# Altium schematic sheet GNSS.SchDoc (part 2 of 3)
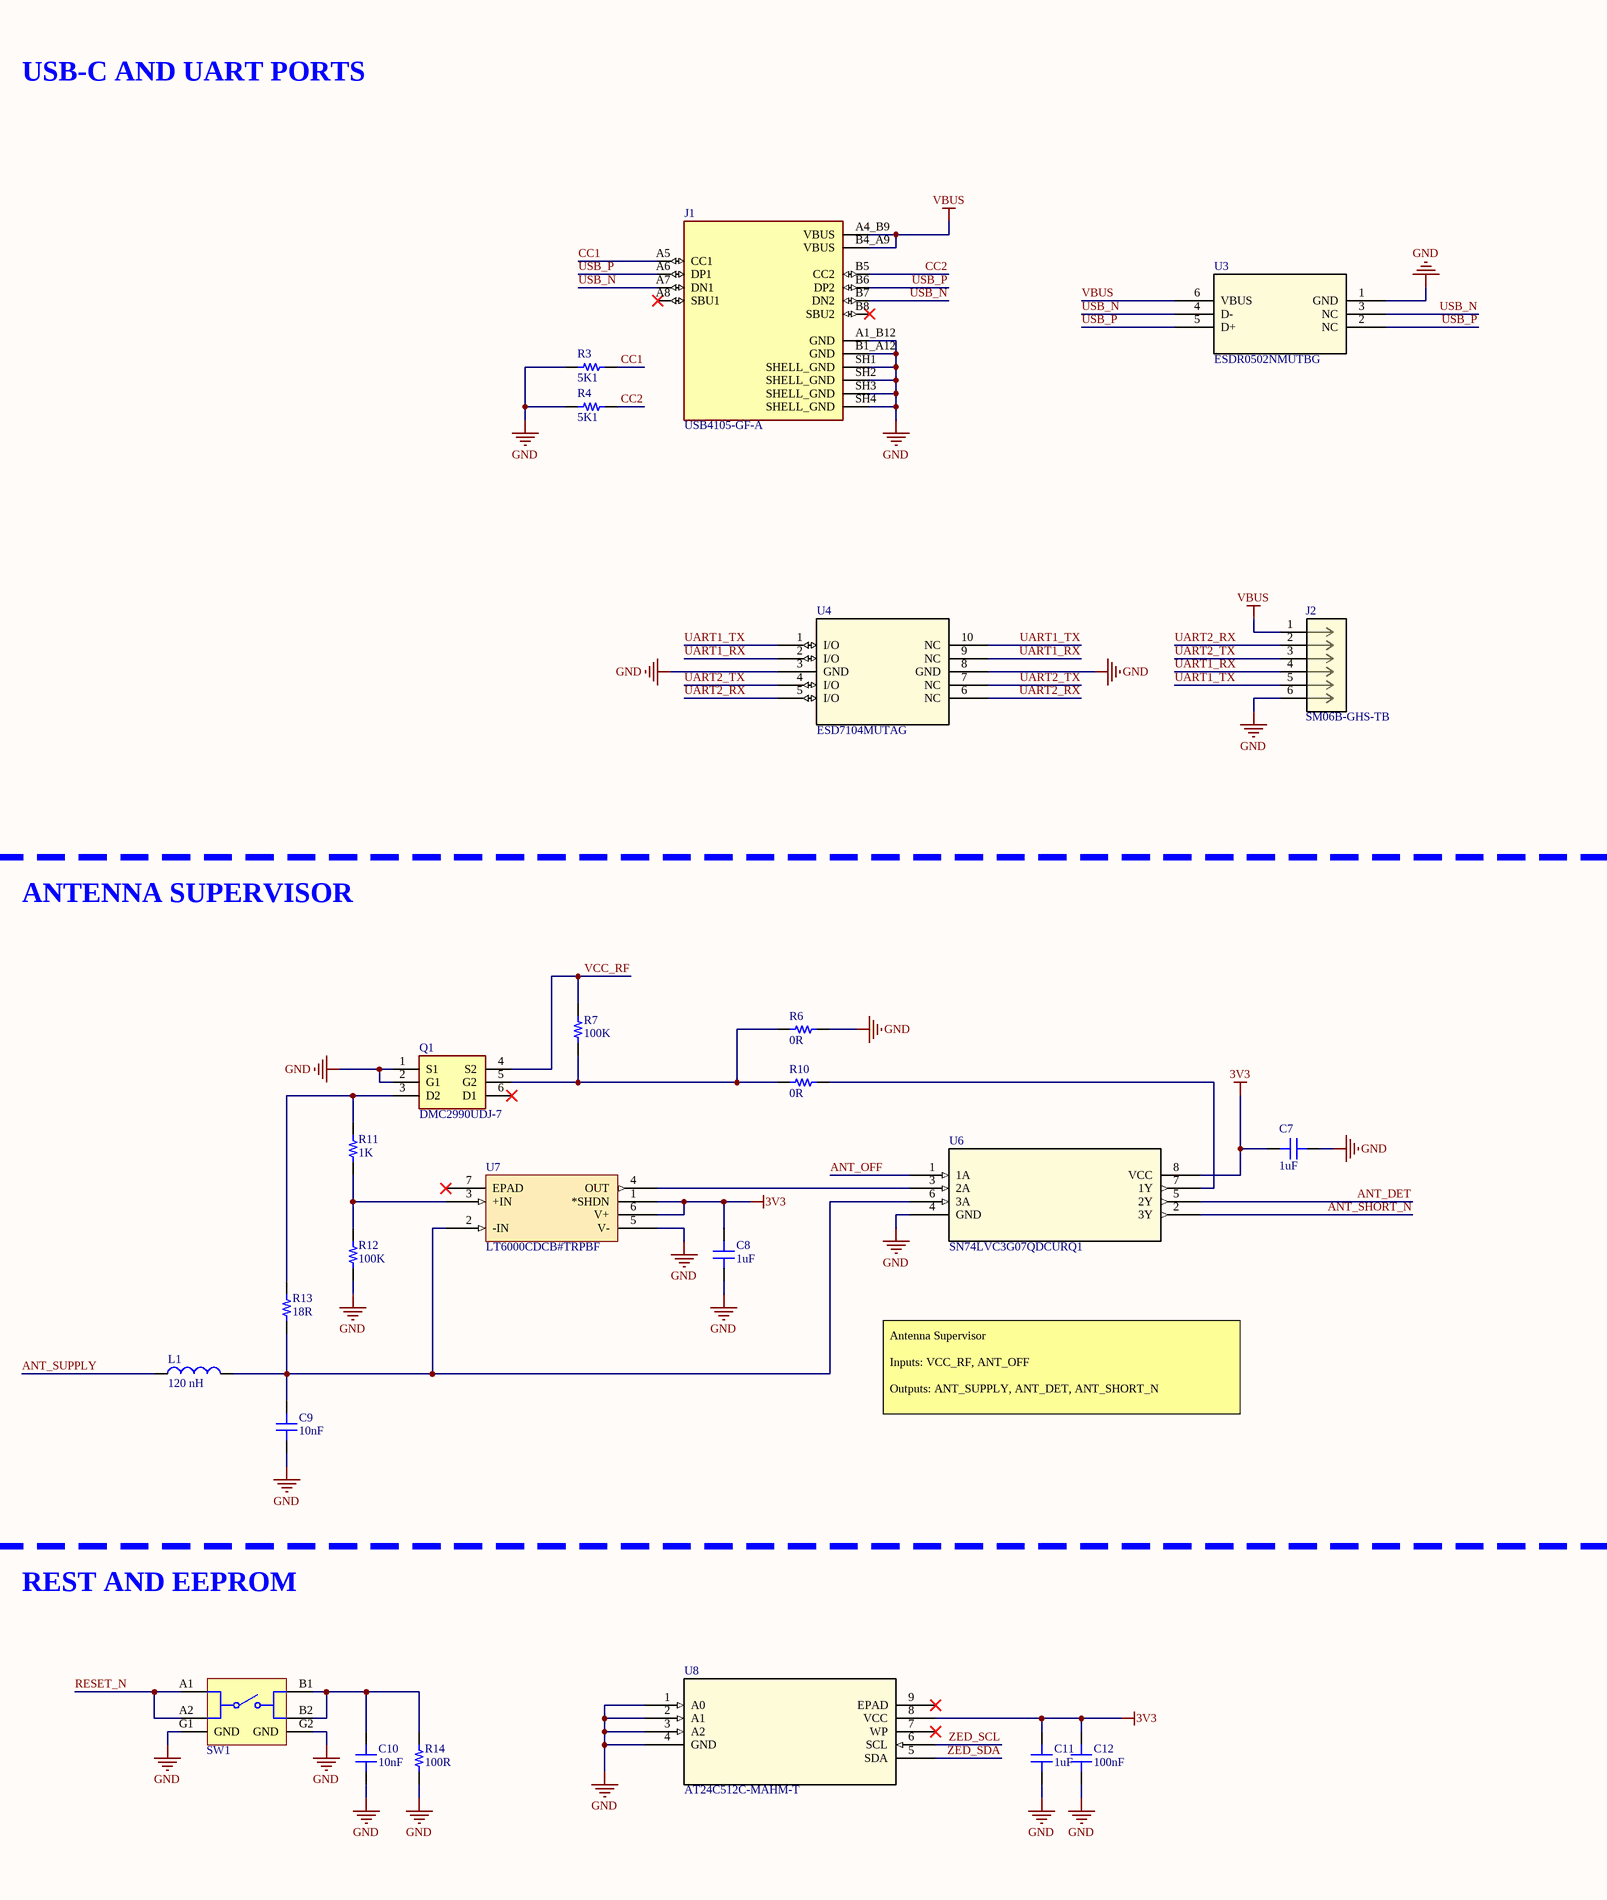
[diagram p2: GNSS.SchDoc, right]
## Library data of the parts
BT1 = MS621FE-FL11E: Coin, 6.8mm 3 V Lithium Battery Rechargeable (Secondary) 5.5mAh; MF: Seiko Instruments; Value: *; Purchase-URL: https://pricing.snapeda.com/search/part/MS621FE-FL11E/?ref=eda; Package: QFP-128 Seiko; Availability: In Stock; Check_prices: https://www.snapeda.com/parts/MS621FE-FL11E/Seiko+Instruments/view-part/?ref=eda; Price: None; SnapEDA_Link: https://www.snapeda.com/parts/MS621FE-FL11E/Seiko+Instruments/view-part/?ref=snap; MPN: MS621FE-FL11E
C1 C2 = GRM155R61A106ME11D: Ceramic Capacitor, Ceramic, 10V, 20% +Tol, 20% -Tol, X5R, 15% TC, 10uF, Surface Mount, 0402; Manufacturer: Murata; Manufacturer Lifecycle Status: IN PRODUCTION; Value: 10µF; Supplier: DigiKey; Supplier Part Number: 490-GRM155R61A106ME11DCT-ND; MPN: GRM155R61A106ME11D; RoHS: Compliant; Category: Ceramic Capacitors; Stock: 1548065; Pricing: 1=0.08, 10=0.014 (USD); Case/Package: 0402; Dielectric: X5R; Dielectric Material: Ceramic; Height: 500µm; Length: 1mm; Lifecycle Status: Production; Material: Ceramic; Max Operating Temperature: 85°C; Min Operating Temperature: -55°C; Mounting Technology: Surface Mount; Number of Terminals: 2; REACH SVHC: Yes; Thickness: 500µm; Tolerance: 20%; Voltage Rating: 10V; Voltage Rating (DC): 10V; Width: 500µm; ComponentLink1URL: https://datasheet.octopart.com:443/GRM155R61A106ME11D-Murata-datasheet-155239053.pdf?src-supplier=Newark; ComponentLink1Description: https://datasheet.octopart.com:443/GRM155R61A106ME11D-Murata-datasheet-155239053.pdf?src-supplier=Newark; ComponentLink2URL: https://datasheet.octopart.com:443/GRM155R61A106ME11D-Murata-datasheet-178522865.pdf?src-supplier=Arrow.cn; ComponentLink2Description: https://datasheet.octopart.com:443/GRM155R61A106ME11D-Murata-datasheet-178522865.pdf?src-supplier=Arrow.cn; ComponentLink3URL: https://datasheet.octopart.com:443/GRM155R61A106ME11D-Murata-datasheet-165579666.pdf?src-supplier=TME; ComponentLink3Description: https://datasheet.octopart.com:443/GRM155R61A106ME11D-Murata-datasheet-165579666.pdf?src-supplier=TME; ComponentLink4URL: https://datasheet.octopart.com:443/GRM155R61A106ME11D-Murata-datasheet-141266224.pdf?src-supplier=Ciiva; ComponentLink4Description: https://datasheet.octopart.com:443/GRM155R61A106ME11D-Murata-datasheet-141266224.pdf?src-supplier=Ciiva; ComponentLink5URL: https://datasheet.octopart.com:443/GRM155R61A106ME11D-Murata-datasheet-140689744.pdf?src-supplier=Ciiva; ComponentLink5Description: https://datasheet.octopart.com:443/GRM155R61A106ME11D-Murata-datasheet-140689744.pdf?src-supplier=Ciiva; ComponentLink6URL: https://datasheet.octopart.com:443/GRM155R61A106ME11D-Murata-datasheet-138740692.pdf?src-supplier=Ciiva; ComponentLink6Description: https://datasheet.octopart.com:443/GRM155R61A106ME11D-Murata-datasheet-138740692.pdf?src-supplier=Ciiva; ComponentLink7URL: https://datasheet.octopart.com/GRM155R61A106ME11D-Murata-datasheet-12515295.pdf; ComponentLink7Description: https://datasheet.octopart.com/GRM155R61A106ME11D-Murata-datasheet-12515295.pdf; ComponentLink8URL: https://datasheet.octopart.com/GRM155R61A106ME11D-Murata-datasheet-12510076.pdf; ComponentLink8Description: https://datasheet.octopart.com/GRM155R61A106ME11D-Murata-datasheet-12510076.pdf; ComponentLink9URL: https://datasheet.octopart.com/GRM155R61A106ME11D-Murata-datasheet-11978611.pdf; ComponentLink9Description: https://datasheet.octopart.com/GRM155R61A106ME11D-Murata-datasheet-11978611.pdf; ComponentLink10URL: https://datasheet.octopart.com/GRM155R61A106ME11D-Murata-datasheet-10025737.pdf; ComponentLink10Description: https://datasheet.octopart.com/GRM155R61A106ME11D-Murata-datasheet-10025737.pdf; ComponentLink11URL: https://datasheet.octopart.com/GRM155R61A106ME11D-Murata-datasheet-8819587.pdf; ComponentLink11Description: https://datasheet.octopart.com/GRM155R61A106ME11D-Murata-datasheet-8819587.pdf; ComponentLink12URL: http://sigma.octopart.com:80/reach_statement/Murata-company-16.pdf?src-supplier=Compliance+Statements; ComponentLink12Description: http://sigma.octopart.com:80/reach_statement/Murata-company-16.pdf?src-supplier=Compliance+Statements
C3 C5 C7 C8 C11 = GRM155C81C105KE11D: Ceramic Capacitor, Ceramic, 16V, 10% +Tol, 10% -Tol, X6S, 22% TC, 1uF, Surface Mount, 0402; Manufacturer: Murata; Manufacturer Lifecycle Status: IN PRODUCTION; Value: 1µF; Supplier: DigiKey; Supplier Part Number: 490-12700-1-ND; MPN: GRM155C81C105KE11D; RoHS: Compliant; Category: Ceramic Capacitors; Stock: 234756; Pricing: 1=0.1, 10=0.045, 50=0.031, 100=0.0267, 500=0.01938, 1000=0.01713, 2500=0.01478 (USD); Case/Package: 0402; Case Code (Imperial): 0402; Case Code (Metric): 1005; Composition: Ceramic; Dielectric: X6S; Dielectric Material: Ceramic; Height: 500µm; Lead Free: Lead Free; Length: 1mm; Lifecycle Status: Production; Material: Ceramic; Max Operating Temperature: 105°C; Min Operating Temperature: -55°C; Mounting Technology: Surface Mount; Number of Terminals: 2; Packaging: Cut Tape (CT); REACH SVHC: Yes; Schedule B: 8532240020, 8532240020|8532240020|8532240020|8532240020|8532240020; Termination: SMD/SMT; Thickness: 500µm; Tolerance: 10%; Voltage Rating: 16V; Voltage Rating (DC): 16V; Weight: 6.010099mg; Width: 500µm; ComponentLink1URL: https://datasheet.octopart.com:443/GRM155C81C105KE11D-Murata-datasheet-149522934.pdf?src-supplier=Newark; ComponentLink1Description: https://datasheet.octopart.com:443/GRM155C81C105KE11D-Murata-datasheet-149522934.pdf?src-supplier=Newark; ComponentLink2URL: https://datasheet.octopart.com:443/GRM155C81C105KE11D-Murata-datasheet-165579666.pdf?src-supplier=TME; ComponentLink2Description: https://datasheet.octopart.com:443/GRM155C81C105KE11D-Murata-datasheet-165579666.pdf?src-supplier=TME; ComponentLink3URL: https://datasheet.octopart.com:443/GRM155C81C105KE11D-Murata-datasheet-141266224.pdf?src-supplier=Ciiva; ComponentLink3Description: https://datasheet.octopart.com:443/GRM155C81C105KE11D-Murata-datasheet-141266224.pdf?src-supplier=Ciiva; ComponentLink4URL: https://datasheet.octopart.com:443/GRM155C81C105KE11D-Murata-datasheet-140688092.pdf?src-supplier=Ciiva; ComponentLink4Description: https://datasheet.octopart.com:443/GRM155C81C105KE11D-Murata-datasheet-140688092.pdf?src-supplier=Ciiva; ComponentLink5URL: https://datasheet.octopart.com:443/GRM155C81C105KE11D-Murata-datasheet-138740516.pdf?src-supplier=Ciiva; ComponentLink5Description: https://datasheet.octopart.com:443/GRM155C81C105KE11D-Murata-datasheet-138740516.pdf?src-supplier=Ciiva; ComponentLink6URL: https://datasheet.octopart.com:443/GRM155C81C105KE11D-Murata-datasheet-22122223.pdf?src-supplier=Future+Electronics; ComponentLink6Description: https://datasheet.octopart.com:443/GRM155C81C105KE11D-Murata-datasheet-22122223.pdf?src-supplier=Future+Electronics; ComponentLink7URL: https://datasheet.octopart.com/GRM155C81C105KE11D-Murata-datasheet-12515295.pdf; ComponentLink7Description: https://datasheet.octopart.com/GRM155C81C105KE11D-Murata-datasheet-12515295.pdf; ComponentLink8URL: https://datasheet.octopart.com/GRM155C81C105KE11D-Murata-datasheet-12510076.pdf; ComponentLink8Description: https://datasheet.octopart.com/GRM155C81C105KE11D-Murata-datasheet-12510076.pdf; ComponentLink9URL: https://datasheet.octopart.com/GRM155C81C105KE11D-Murata-datasheet-11978611.pdf; ComponentLink9Description: https://datasheet.octopart.com/GRM155C81C105KE11D-Murata-datasheet-11978611.pdf; ComponentLink10URL: https://datasheet.octopart.com/GRM155C81C105KE11D-Murata-datasheet-10025737.pdf; ComponentLink10Description: https://datasheet.octopart.com/GRM155C81C105KE11D-Murata-datasheet-10025737.pdf; ComponentLink11URL: https://datasheet.octopart.com/GRM155C81C105KE11D-Murata-datasheet-8819587.pdf; ComponentLink11Description: https://datasheet.octopart.com/GRM155C81C105KE11D-Murata-datasheet-8819587.pdf; ComponentLink12URL: https://datasheet.octopart.com/GRM155C81C105KE11D-Murata-datasheet-38882735.pdf; ComponentLink12Description: https://datasheet.octopart.com/GRM155C81C105KE11D-Murata-datasheet-38882735.pdf; ComponentLink13URL: http://sigma.octopart.com:80/reach_statement/Murata-company-16.pdf?src-supplier=Compliance+Statements; ComponentLink13Description: http://sigma.octopart.com:80/reach_statement/Murata-company-16.pdf?src-supplier=Compliance+Statements
C4 C12 = C0402C104K8RACTU: Capacitor, Multilayer, Ceramic, 10V, 10%, X7R, 15% Tc, 0.1Uf, Surface Mount, 0402; Manufacturer: KEMET; Dissipation Factor: 5%; Supplier: DigiKey; Supplier Part Number: 399-C0402C104K8RACTUCT-ND; MPN: C0402C104K8RACTU; RoHS: Compliant; Category: Ceramic Capacitors; Stock: 3340670; Pricing: 1=0.1, 10=0.029, 50=0.0198, 100=0.0168, 500=0.01192, 1000=0.01043, 2500=0.00886, 5000=0.00792 (USD); Value: 100nF; Case/Package: 0402; Case Code (Imperial): 0402; China RoHS: Compliant; Depth: 500µm; Dielectric: X7R; Dielectric Material: Ceramic; Height: 500µm; Lead Free: Lead Free; Lead Pitch: 300µm; Length: 1mm; Lifecycle Status: Production; Material: Ceramic; Max Operating Temperature: 125°C; Min Operating Temperature: -55°C; Mounting Technology: Surface Mount; Pins: 2; Number of Terminals: 2; Packaging: Cut Tape; Radiation Hardening: No; REACH SVHC: Yes; Schedule B: 8532240020, 8532240020|8532240020|8532240020|8532240020|8532240020; Termination: SMD/SMT; Thickness: 558.8µm; Tolerance: 10%; Voltage: 10V; Voltage Rating: 10V; Voltage Rating (DC): 10V; Width: 500µm; ComponentLink1URL: https://datasheet.octopart.com:443/C0402C104K8RACTU-KEMET-datasheet-178445679.pdf?src-supplier=IHS; ComponentLink1Description: https://datasheet.octopart.com:443/C0402C104K8RACTU-KEMET-datasheet-178445679.pdf?src-supplier=IHS; ComponentLink2URL: https://datasheet.octopart.com:443/C0402C104K8RACTU-KEMET-datasheet-137357759.pdf?src-supplier=Farnell; ComponentLink2Description: https://datasheet.octopart.com:443/C0402C104K8RACTU-KEMET-datasheet-137357759.pdf?src-supplier=Farnell; ComponentLink3URL: https://datasheet.octopart.com:443/C0402C104K8RACTU-KEMET-datasheet-149521634.pdf?src-supplier=Farnell; ComponentLink3Description: https://datasheet.octopart.com:443/C0402C104K8RACTU-KEMET-datasheet-149521634.pdf?src-supplier=Farnell; ComponentLink4URL: https://datasheet.octopart.com:443/C0402C104K8RACTU-Kemet-datasheet-12608295.pdf?src-supplier=Farnell; ComponentLink4Description: https://datasheet.octopart.com:443/C0402C104K8RACTU-Kemet-datasheet-12608295.pdf?src-supplier=Farnell; ComponentLink5URL: https://datasheet.octopart.com:443/C0402C104K8RACTU-Kemet-datasheet-11992184.pdf?src-supplier=Farnell; ComponentLink5Description: https://datasheet.octopart.com:443/C0402C104K8RACTU-Kemet-datasheet-11992184.pdf?src-supplier=Farnell; ComponentLink6URL: https://datasheet.octopart.com:443/C0402C104K8RACTU-Kemet-datasheet-10942409.pdf?src-supplier=Farnell; ComponentLink6Description: https://datasheet.octopart.com:443/C0402C104K8RACTU-Kemet-datasheet-10942409.pdf?src-supplier=Farnell; ComponentLink7URL: https://datasheet.octopart.com:443/C0402C104K8RACTU-Kemet-datasheet-10404442.pdf?src-supplier=Farnell; ComponentLink7Description: https://datasheet.octopart.com:443/C0402C104K8RACTU-Kemet-datasheet-10404442.pdf?src-supplier=Farnell; ComponentLink8URL: https://datasheet.octopart.com:443/C0402C104K8RACTU-KEMET-datasheet-101575473.pdf?src-supplier=Farnell; ComponentLink8Description: https://datasheet.octopart.com:443/C0402C104K8RACTU-KEMET-datasheet-101575473.pdf?src-supplier=Farnell; ComponentLink9URL: https://datasheet.octopart.com:443/C0402C104K8RACTU-Kemet-datasheet-41232427.pdf?src-supplier=Farnell; ComponentLink9Description: https://datasheet.octopart.com:443/C0402C104K8RACTU-Kemet-datasheet-41232427.pdf?src-supplier=Farnell; ComponentLink10URL: https://datasheet.octopart.com:443/C0402C104K8RACTU-Kemet-datasheet-32036385.pdf?src-supplier=Electro+Sonic; ComponentLink10Description: https://datasheet.octopart.com:443/C0402C104K8RACTU-Kemet-datasheet-32036385.pdf?src-supplier=Electro+Sonic; ComponentLink11URL: https://datasheet.octopart.com:443/C0402C104K8RACTU-KEMET-datasheet-157246124.pdf?src-supplier=Electro+Sonic; ComponentLink11Description: https://datasheet.octopart.com:443/C0402C104K8RACTU-KEMET-datasheet-157246124.pdf?src-supplier=Electro+Sonic; ComponentLink12URL: https://datasheet.octopart.com:443/C0402C104K8RACTU-Kemet-datasheet-27203261.pdf?src-supplier=Newark; ComponentLink12Description: https://datasheet.octopart.com:443/C0402C104K8RACTU-Kemet-datasheet-27203261.pdf?src-supplier=Newark; ComponentLink13URL: https://datasheet.octopart.com:443/C0402C104K8RACTU-KEMET-datasheet-176289274.pdf?src-supplier=Newark; ComponentLink13Description: https://datasheet.octopart.com:443/C0402C104K8RACTU-KEMET-datasheet-176289274.pdf?src-supplier=Newark; ComponentLink14URL: https://datasheet.octopart.com:443/C0402C104K8RACTU-Kemet-datasheet-5313890.pdf?src-supplier=element14; ComponentLink14Description: https://datasheet.octopart.com:443/C0402C104K8RACTU-Kemet-datasheet-5313890.pdf?src-supplier=element14; ComponentLink15URL: https://datasheet.octopart.com:443/C0402C104K8RACTU-Kemet-datasheet-8764837.pdf?src-supplier=element14; ComponentLink15Description: https://datasheet.octopart.com:443/C0402C104K8RACTU-Kemet-datasheet-8764837.pdf?src-supplier=element14; ComponentLink16URL: https://datasheet.octopart.com:443/C0402C104K8RACTU-Kemet-datasheet-8480123.pdf?src-supplier=element14; ComponentLink16Description: https://datasheet.octopart.com:443/C0402C104K8RACTU-Kemet-datasheet-8480123.pdf?src-supplier=element14; ComponentLink17URL: https://datasheet.octopart.com:443/C0402C104K8RACTU-Kemet-datasheet-5390537.pdf?src-supplier=element14; ComponentLink17Description: https://datasheet.octopart.com:443/C0402C104K8RACTU-Kemet-datasheet-5390537.pdf?src-supplier=element14; ComponentLink18URL: https://datasheet.octopart.com:443/C0402C104K8RACTU-Kemet-datasheet-5393970.pdf?src-supplier=element14; ComponentLink18Description: https://datasheet.octopart.com:443/C0402C104K8RACTU-Kemet-datasheet-5393970.pdf?src-supplier=element14; ComponentLink19URL: https://datasheet.octopart.com:443/C0402C104K8RACTU-Kemet-datasheet-8502025.pdf?src-supplier=element14; ComponentLink19Description: https://datasheet.octopart.com:443/C0402C104K8RACTU-Kemet-datasheet-8502025.pdf?src-supplier=element14; ComponentLink20URL: https://datasheet.octopart.com:443/C0402C104K8RACTU-Kemet-datasheet-7541751.pdf?src-supplier=element14; ComponentLink20Description: https://datasheet.octopart.com:443/C0402C104K8RACTU-Kemet-datasheet-7541751.pdf?src-supplier=element14; ComponentLink21URL: https://datasheet.octopart.com:443/C0402C104K8RACTU-Kemet-datasheet-161801.pdf?src-supplier=element14; ComponentLink21Description: https://datasheet.octopart.com:443/C0402C104K8RACTU-Kemet-datasheet-161801.pdf?src-supplier=element14; ComponentLink22URL: https://datasheet.octopart.com:443/C0402C104K8RACTU-KEMET-datasheet-164512540.pdf?src-supplier=TME; ComponentLink22Description: https://datasheet.octopart.com:443/C0402C104K8RACTU-KEMET-datasheet-164512540.pdf?src-supplier=TME; ComponentLink23URL: https://datasheet.octopart.com:443/C0402C104K8RACTU-KEMET-datasheet-98355703.pdf?src-supplier=TME; ComponentLink23Description: https://datasheet.octopart.com:443/C0402C104K8RACTU-KEMET-datasheet-98355703.pdf?src-supplier=TME; ComponentLink24URL: https://datasheet.octopart.com:443/C0402C104K8RACTU-KEMET-datasheet-68331906.pdf?src-supplier=TME; ComponentLink24Description: https://datasheet.octopart.com:443/C0402C104K8RACTU-KEMET-datasheet-68331906.pdf?src-supplier=TME; ComponentLink25URL: https://datasheet.octopart.com:443/C0402C104K8RACTU-KEMET-datasheet-110724412.pdf?src-supplier=RS+(Formerly+Allied+Electronics); ComponentLink25Description: https://datasheet.octopart.com:443/C0402C104K8RACTU-KEMET-datasheet-110724412.pdf?src-supplier=RS+(Formerly+Allied+Electronics); ComponentLink26URL: https://datasheet.octopart.com:443/C0402C104K8RACTU-Kemet-datasheet-464.pdf?src-supplier=RS+(Formerly+Allied+Electronics); ComponentLink26Description: https://datasheet.octopart.com:443/C0402C104K8RACTU-Kemet-datasheet-464.pdf?src-supplier=RS+(Formerly+Allied+Electronics); ComponentLink27URL: https://datasheet.octopart.com/C0402C104K8RACTU-KEMET-datasheet-84169754.pdf; ComponentLink27Description: https://datasheet.octopart.com/C0402C104K8RACTU-KEMET-datasheet-84169754.pdf; ComponentLink28URL: https://datasheet.octopart.com:443/C0402C104K8RACTU-Kemet-datasheet-11890967.pdf?src-supplier=Arrow+Electronics; ComponentLink28Description: https://datasheet.octopart.com:443/C0402C104K8RACTU-Kemet-datasheet-11890967.pdf?src-supplier=Arrow+Electronics; ComponentLink29URL: https://datasheet.octopart.com:443/C0402C104K8RAC-TU-Kemet-datasheet-7553948.pdf?src-supplier=Jameco; ComponentLink29Description: https://datasheet.octopart.com:443/C0402C104K8RAC-TU-Kemet-datasheet-7553948.pdf?src-supplier=Jameco
C6 = CC0603KRX5R5BB475: Multilayer Ceramic Capacitor, CC Series, 4.7 - F, - 10%, X5R, 6.3 V, 0603 [1608 Metric]; Manufacturer: Yageo Group; Value: 4.7µF; Voltage Rating: 6.3V; Supplier: DigiKey; Supplier Part Number: 311-1521-1-ND; MPN: CC0603KRX5R5BB475; RoHS: Compliant; Category: Ceramic Capacitors; Stock: 76894; Pricing: 1=0.2, 10=0.114, 50=0.0814, 100=0.0714, 500=0.0545, 1000=0.04931 (USD); Case/Package: 0603; Case Code (Imperial): 0603; Case Code (Metric): 1608; China RoHS: Compliant; Composition: Ceramic; Depth: 800µm; Dielectric: X5R; Dielectric Material: Ceramic; Dissipation Factor: 10%; Halogen Free: Halogen Free; Height: 800µm; Lead Free: Lead Free; Length: 1.6mm; Lifecycle Status: Production; Material: Ceramic; Max Operating Temperature: 85°C; Min Operating Temperature: -55°C; Mounting Technology: Surface Mount; Pins: 2; Number of Terminals: 2; Radiation Hardening: No; REACH SVHC: Yes; Schedule B: 8532240020, 8532240020|8532240020, 8532240020|8532240020|8532240020, 8532240020|8532240020|8532240020|8532240020; Termination: SMD/SMT; Thickness: 889µm; Tolerance: 10%; Voltage Rating (AC): 6.3V; Voltage Rating (DC): 6.3V; Width: 800µm; ComponentLink1URL: https://datasheet.octopart.com:443/CC0603KRX5R5BB475-Yageo-datasheet-170350636.pdf?src-supplier=IHS; ComponentLink1Description: https://datasheet.octopart.com:443/CC0603KRX5R5BB475-Yageo-datasheet-170350636.pdf?src-supplier=IHS; ComponentLink2URL: https://datasheet.octopart.com:443/CC0603KRX5R5BB475-Yageo-datasheet-82288757.pdf?src-supplier=Upverter; ComponentLink2Description: https://datasheet.octopart.com:443/CC0603KRX5R5BB475-Yageo-datasheet-82288757.pdf?src-supplier=Upverter; ComponentLink3URL: https://datasheet.octopart.com:443/CC0603KRX5R5BB475-Yageo-datasheet-78855687.pdf?src-supplier=Upverter; ComponentLink3Description: https://datasheet.octopart.com:443/CC0603KRX5R5BB475-Yageo-datasheet-78855687.pdf?src-supplier=Upverter; ComponentLink4URL: https://datasheet.octopart.com:443/CC0603KRX5R5BB475-Yageo-datasheet-42079887.pdf?src-supplier=Upverter; ComponentLink4Description: https://datasheet.octopart.com:443/CC0603KRX5R5BB475-Yageo-datasheet-42079887.pdf?src-supplier=Upverter; ComponentLink5URL: https://datasheet.octopart.com:443/CC0603KRX5R5BB475-Yageo-datasheet-184398204.pdf?src-supplier=Newark; ComponentLink5Description: https://datasheet.octopart.com:443/CC0603KRX5R5BB475-Yageo-datasheet-184398204.pdf?src-supplier=Newark; ComponentLink6URL: https://datasheet.octopart.com:443/CC0603KRX5R5BB475-Yageo-datasheet-181968509.pdf?src-supplier=Newark; ComponentLink6Description: https://datasheet.octopart.com:443/CC0603KRX5R5BB475-Yageo-datasheet-181968509.pdf?src-supplier=Newark; ComponentLink7URL: https://datasheet.octopart.com:443/CC0603KRX5R5BB475-Yageo-datasheet-158238148.pdf?src-supplier=Newark; ComponentLink7Description: https://datasheet.octopart.com:443/CC0603KRX5R5BB475-Yageo-datasheet-158238148.pdf?src-supplier=Newark; ComponentLink8URL: https://datasheet.octopart.com:443/CC0603KRX5R5BB475-Yageo-datasheet-8359971.pdf?src-supplier=Newark; ComponentLink8Description: https://datasheet.octopart.com:443/CC0603KRX5R5BB475-Yageo-datasheet-8359971.pdf?src-supplier=Newark; ComponentLink9URL: https://datasheet.octopart.com:443/CC0603KRX5R5BB475-Yageo-datasheet-8324442.pdf?src-supplier=element14+APAC; ComponentLink9Description: https://datasheet.octopart.com:443/CC0603KRX5R5BB475-Yageo-datasheet-8324442.pdf?src-supplier=element14+APAC; ComponentLink10URL: https://datasheet.octopart.com:443/CC0603KRX5R5BB475-Yageo-datasheet-62067349.pdf?src-supplier=element14+APAC; ComponentLink10Description: https://datasheet.octopart.com:443/CC0603KRX5R5BB475-Yageo-datasheet-62067349.pdf?src-supplier=element14+APAC; ComponentLink11URL: https://datasheet.octopart.com/CC0603KRX5R5BB475-Yageo-datasheet-86397281.pdf; ComponentLink11Description: https://datasheet.octopart.com/CC0603KRX5R5BB475-Yageo-datasheet-86397281.pdf; ComponentLink12URL: https://datasheet.octopart.com:443/CC0603KRX5R5BB475-Yageo-datasheet-10911834.pdf?src-supplier=Farnell; ComponentLink12Description: https://datasheet.octopart.com:443/CC0603KRX5R5BB475-Yageo-datasheet-10911834.pdf?src-supplier=Farnell; ComponentLink13URL: https://datasheet.octopart.com:443/CC0603KRX5R5BB475-Yageo-Group-datasheet-184398209.pdf?src-supplier=Farnell; ComponentLink13Description: https://datasheet.octopart.com:443/CC0603KRX5R5BB475-Yageo-Group-datasheet-184398209.pdf?src-supplier=Farnell; ComponentLink14URL: https://datasheet.octopart.com:443/CC0603KRX5R5BB475-Yageo-datasheet-500777.pdf?src-supplier=Farnell; ComponentLink14Description: https://datasheet.octopart.com:443/CC0603KRX5R5BB475-Yageo-datasheet-500777.pdf?src-supplier=Farnell; ComponentLink15URL: https://datasheet.octopart.com:443/CC0603KRX5R5BB475-Yageo-datasheet-519481.pdf?src-supplier=element14; ComponentLink15Description: https://datasheet.octopart.com:443/CC0603KRX5R5BB475-Yageo-datasheet-519481.pdf?src-supplier=element14; ComponentLink16URL: https://datasheet.octopart.com:443/CC0603KRX5R5BB475-Yageo-datasheet-8701639.pdf?src-supplier=element14; ComponentLink16Description: https://datasheet.octopart.com:443/CC0603KRX5R5BB475-Yageo-datasheet-8701639.pdf?src-supplier=element14; ComponentLink17URL: https://datasheet.octopart.com:443/CC0603KRX5R5BB475-Yageo-datasheet-175963154.pdf?src-supplier=JRH+Electronics; ComponentLink17Description: https://datasheet.octopart.com:443/CC0603KRX5R5BB475-Yageo-datasheet-175963154.pdf?src-supplier=JRH+Electronics; ComponentLink18URL: https://datasheet.octopart.com:443/CC0603KRX5R5BB475-Yageo-datasheet-149070021.pdf?src-supplier=TME; ComponentLink18Description: https://datasheet.octopart.com:443/CC0603KRX5R5BB475-Yageo-datasheet-149070021.pdf?src-supplier=TME; ComponentLink19URL: https://datasheet.octopart.com:443/CC0603KRX5R5BB475-Yageo-Group-datasheet-145016144.pdf?src-supplier=ODG+(Origin+Data+Global); ComponentLink19Description: https://datasheet.octopart.com:443/CC0603KRX5R5BB475-Yageo-Group-datasheet-145016144.pdf?src-supplier=ODG+(Origin+Data+Global); ComponentLink20URL: https://datasheet.octopart.com:443/CC0603KRX5R5BB475-Yageo-datasheet-137875056.pdf?src-supplier=Future+Electronics; ComponentLink20Description: https://datasheet.octopart.com:443/CC0603KRX5R5BB475-Yageo-datasheet-137875056.pdf?src-supplier=Future+Electronics; ComponentLink21URL: https://datasheet.octopart.com:443/CC0603KRX5R5BB475-Yageo-datasheet-137700082.pdf?src-supplier=Future+Electronics; ComponentLink21Description: https://datasheet.octopart.com:443/CC0603KRX5R5BB475-Yageo-datasheet-137700082.pdf?src-supplier=Future+Electronics; ComponentLink22URL: https://datasheet.octopart.com:443/CC0603KRX5R5BB475-Yageo-datasheet-137700085.pdf?src-supplier=Future+Electronics; ComponentLink22Description: https://datasheet.octopart.com:443/CC0603KRX5R5BB475-Yageo-datasheet-137700085.pdf?src-supplier=Future+Electronics; ComponentLink23URL: https://datasheet.octopart.com:443/CC0603KRX5R5BB475-Yageo-datasheet-59875459.pdf?src-supplier=Future+Electronics; ComponentLink23Description: https://datasheet.octopart.com:443/CC0603KRX5R5BB475-Yageo-datasheet-59875459.pdf?src-supplier=Future+Electronics; ComponentLink24URL: https://datasheet.octopart.com:443/CC0603KRX5R5BB475-Yageo-datasheet-27626583.pdf?src-supplier=Future+Electronics; ComponentLink24Description: https://datasheet.octopart.com:443/CC0603KRX5R5BB475-Yageo-datasheet-27626583.pdf?src-supplier=Future+Electronics; ComponentLink25URL: https://datasheet.octopart.com:443/CC0603KRX5R5BB475-Yageo-datasheet-15895757.pdf?src-supplier=Future+Electronics; ComponentLink25Description: https://datasheet.octopart.com:443/CC0603KRX5R5BB475-Yageo-datasheet-15895757.pdf?src-supplier=Future+Electronics; ComponentLink26URL: https://datasheet.octopart.com:443/CC0603KRX5R5BB475-Yageo-datasheet-14389981.pdf?src-supplier=Future+Electronics; ComponentLink26Description: https://datasheet.octopart.com:443/CC0603KRX5R5BB475-Yageo-datasheet-14389981.pdf?src-supplier=Future+Electronics; ComponentLink27URL: http://sigma.octopart.com:80/rohs_statement/Yageo-company-2.pdf?src-supplier=Compliance+Statements; ComponentLink27Description: http://sigma.octopart.com:80/rohs_statement/Yageo-company-2.pdf?src-supplier=Compliance+Statements; ComponentLink28URL: http://sigma.octopart.com:80/conflict_mineral_statement/Yageo-company-3.pdf?src-supplier=Compliance+Statements; ComponentLink28Description: http://sigma.octopart.com:80/conflict_mineral_statement/Yageo-company-3.pdf?src-supplier=Compliance+Statements
C9 = GRM155R71C103KA01D: 0402 10000 pF 16 V ±10% Tolerance X7R Multilayer Ceramic Chip Capacitor; Manufacturer: Murata; Manufacturer Lifecycle Status: NRND; Voltage: 16V; Supplier: DigiKey; Supplier Part Number: 490-1313-1-ND; MPN: GRM155R71C103KA01D; RoHS: Compliant; Category: Ceramic Capacitors; Stock: 7038790; Pricing: 1=0.08, 10=0.004 (USD); Value: 10nF; Case/Package: 0402; Case Code (Imperial): 0402; Case Code (Metric): 1005; Depth: 500µm; Dielectric: X7R; Dielectric Material: Ceramic; Height: 500µm; Lead Free: Lead Free; Length: 1mm; Lifecycle Status: NRND; Material: Ceramic; Max Operating Temperature: 125°C; Min Operating Temperature: -55°C; Mounting Technology: Surface Mount; Pins: 2; Number of Terminals: 2; Packaging: Cut Tape; Radiation Hardening: No; REACH SVHC: Yes; Schedule B: 8532240020, 8532240020|8532240020, 8532240020|8532240020|8532240020, 8532240020|8532240020|8532240020|8532240020; Termination: SMD/SMT; Thickness: 500µm; Tolerance: 10%; Voltage Rating: 16V; Voltage Rating (DC): 16V; Width: 500µm; ComponentLink1URL: https://datasheet.octopart.com:443/GRM155R71C103KA01D-Murata-datasheet-8817987.pdf?src-supplier=element14+APAC; ComponentLink1Description: https://datasheet.octopart.com:443/GRM155R71C103KA01D-Murata-datasheet-8817987.pdf?src-supplier=element14+APAC; ComponentLink2URL: https://datasheet.octopart.com:443/GRM155R71C103KA01D-Murata-datasheet-62317116.pdf?src-supplier=element14+APAC; ComponentLink2Description: https://datasheet.octopart.com:443/GRM155R71C103KA01D-Murata-datasheet-62317116.pdf?src-supplier=element14+APAC; ComponentLink3URL: https://datasheet.octopart.com:443/GRM155R71C103KA01D-Murata-datasheet-12547956.pdf?src-supplier=_legacy+Avnet; ComponentLink3Description: https://datasheet.octopart.com:443/GRM155R71C103KA01D-Murata-datasheet-12547956.pdf?src-supplier=_legacy+Avnet; ComponentLink4URL: https://datasheet.octopart.com:443/GRM155R71C103KA01D-Murata-datasheet-8330587.pdf?src-supplier=_legacy+Avnet; ComponentLink4Description: https://datasheet.octopart.com:443/GRM155R71C103KA01D-Murata-datasheet-8330587.pdf?src-supplier=_legacy+Avnet; ComponentLink5URL: https://datasheet.octopart.com:443/GRM155R71C103KA01D-Murata-datasheet-165579666.pdf?src-supplier=TME; ComponentLink5Description: https://datasheet.octopart.com:443/GRM155R71C103KA01D-Murata-datasheet-165579666.pdf?src-supplier=TME; ComponentLink6URL: https://datasheet.octopart.com:443/GRM155R71C103KA01D-Murata-datasheet-59876780.pdf?src-supplier=TME; ComponentLink6Description: https://datasheet.octopart.com:443/GRM155R71C103KA01D-Murata-datasheet-59876780.pdf?src-supplier=TME; ComponentLink7URL: https://datasheet.octopart.com:443/GRM155R71C103KA01D-Murata-datasheet-141266224.pdf?src-supplier=Ciiva; ComponentLink7Description: https://datasheet.octopart.com:443/GRM155R71C103KA01D-Murata-datasheet-141266224.pdf?src-supplier=Ciiva; ComponentLink8URL: https://datasheet.octopart.com:443/GRM155R71C103KA01D-Murata-datasheet-140690969.pdf?src-supplier=Ciiva; ComponentLink8Description: https://datasheet.octopart.com:443/GRM155R71C103KA01D-Murata-datasheet-140690969.pdf?src-supplier=Ciiva; ComponentLink9URL: https://datasheet.octopart.com:443/GRM155R71C103KA01D-Murata-datasheet-138740887.pdf?src-supplier=Ciiva; ComponentLink9Description: https://datasheet.octopart.com:443/GRM155R71C103KA01D-Murata-datasheet-138740887.pdf?src-supplier=Ciiva; ComponentLink10URL: https://datasheet.octopart.com:443/GRM155R71C103KA01D-Murata-datasheet-22122223.pdf?src-supplier=Future+Electronics; ComponentLink10Description: https://datasheet.octopart.com:443/GRM155R71C103KA01D-Murata-datasheet-22122223.pdf?src-supplier=Future+Electronics; ComponentLink11URL: https://datasheet.octopart.com:443/GRM155R71C103KA01D-Murata-datasheet-14400559.pdf?src-supplier=Future+Electronics; ComponentLink11Description: https://datasheet.octopart.com:443/GRM155R71C103KA01D-Murata-datasheet-14400559.pdf?src-supplier=Future+Electronics; ComponentLink12URL: https://datasheet.octopart.com:443/GRM155R71C103KA01D-Murata-datasheet-44106282.pdf?src-supplier=Future+Electronics; ComponentLink12Description: https://datasheet.octopart.com:443/GRM155R71C103KA01D-Murata-datasheet-44106282.pdf?src-supplier=Future+Electronics; ComponentLink13URL: https://datasheet.octopart.com/GRM155R71C103KA01D-Murata-datasheet-12515295.pdf; ComponentLink13Description: https://datasheet.octopart.com/GRM155R71C103KA01D-Murata-datasheet-12515295.pdf; ComponentLink14URL: https://datasheet.octopart.com/GRM155R71C103KA01D-Murata-datasheet-12510076.pdf; ComponentLink14Description: https://datasheet.octopart.com/GRM155R71C103KA01D-Murata-datasheet-12510076.pdf; ComponentLink15URL: https://datasheet.octopart.com/GRM155R71C103KA01D-Murata-datasheet-11978611.pdf; ComponentLink15Description: https://datasheet.octopart.com/GRM155R71C103KA01D-Murata-datasheet-11978611.pdf; ComponentLink16URL: https://datasheet.octopart.com/GRM155R71C103KA01D-Murata-datasheet-10025737.pdf; ComponentLink16Description: https://datasheet.octopart.com/GRM155R71C103KA01D-Murata-datasheet-10025737.pdf; ComponentLink17URL: https://datasheet.octopart.com/GRM155R71C103KA01D-Murata-datasheet-8819587.pdf; ComponentLink17Description: https://datasheet.octopart.com/GRM155R71C103KA01D-Murata-datasheet-8819587.pdf; ComponentLink18URL: https://datasheet.octopart.com/GRM155R71C103KA01D-Murata-datasheet-14400564.pdf; ComponentLink18Description: https://datasheet.octopart.com/GRM155R71C103KA01D-Murata-datasheet-14400564.pdf; ComponentLink19URL: https://datasheet.octopart.com:443/GRM155R71C103KA01D-Murata-datasheet-148211.pdf?src-supplier=Garrett; ComponentLink19Description: https://datasheet.octopart.com:443/GRM155R71C103KA01D-Murata-datasheet-148211.pdf?src-supplier=Garrett; ComponentLink20URL: https://datasheet.octopart.com:443/GRM155R71C103KA01D-Murata-datasheet-102.pdf?src-supplier=DigiKey; ComponentLink20Description: https://datasheet.octopart.com:443/GRM155R71C103KA01D-Murata-datasheet-102.pdf?src-supplier=DigiKey; ComponentLink21URL: http://sigma.octopart.com:80/reach_statement/Murata-company-16.pdf?src-supplier=Compliance+Statements; ComponentLink21Description: http://sigma.octopart.com:80/reach_statement/Murata-company-16.pdf?src-supplier=Compliance+Statements
C10 = C0402C103K3REC7411: Multilayer Ceramic Capacitors MLCC - SMD/SMT 25V 0.01uF X7R 0402 10%; Manufacturer: KEMET; Supplier: DigiKey; Supplier Part Number: 399-C0402C103K3REC7411CT-ND; MPN: C0402C103K3REC7411; RoHS: Compliant; Category: Ceramic Capacitors; Stock: 41610; Pricing: 1=0.1, 10=0.056, 50=0.039, 100=0.0336, 500=0.02468, 1000=0.02195, 2500=0.01906, 5000=0.01733 (USD); Value: 10nF; China RoHS: Compliant; Dielectric Material: Ceramic; Height: 500µm; Length: 1mm; Lifecycle Status: Production; Max Operating Temperature: 125°C; Min Operating Temperature: -55°C; Mounting Technology: Surface Mount; Number of Terminals: 2; REACH SVHC: Yes; Voltage Rating (DC): 25V; Width: 500µm; ComponentLink1URL: https://datasheet.octopart.com:443/C0402C103K3REC7411-KEMET-datasheet-178568699.pdf?src-supplier=IHS; ComponentLink1Description: https://datasheet.octopart.com:443/C0402C103K3REC7411-KEMET-datasheet-178568699.pdf?src-supplier=IHS
D1 = PESD0402-140: TVS DIODE 14VWM 40VC 0402; Manufacturer_Name: Littelfuse Inc; Copyright: Copyright (C) 2025 Ultra Librarian. All rights reserved.; MPN: PESD0402-140
J1 = USB4105-GF-A: CONN RCP USB2.0 TYP C 24P SMD RA; MF: {'manufacturer': u'GCT'}; Package: None; Price: None; Value: *; MPN: USB4105-GF-A; Availability: Unavailable
J2 = SM06B-GHS-TB: CONN HEADER SMD R/A 6POS 1.25MM; Manufacturer_Name: JST; Copyright: Copyright (C) 2025 Ultra Librarian. All rights reserved.; MPN: SM06B-GHS-TB; RefDes: RefDes; Type: Type
J3 = CONMHF1-SMD-G-T: U.FL/MHF1 Jack 50 Ohm PCB Surface Mount; MF: TE Connectivity; SnapEDA_Link: https://www.snapeda.com/parts/CONMHF1-SMD-G-T/TE+Connectivity/view-part/?ref=snap; Package: None; Value: *; MPN: CONMHF1-SMD-G-T; Check_prices: https://www.snapeda.com/parts/CONMHF1-SMD-G-T/TE+Connectivity/view-part/?ref=eda
L1 = LQW15ANR12J00D: Inductor with Inductance: 120nH Tol. +/-5%, Package: 0402 _1005_; MF: Murata; Digi-Key_Part_Number: 490-4091-1-ND; Value: *; MPN: LQW15ANR12J00D; SnapEDA_Link: https://www.snapeda.com/parts/LQW15ANR12J00D/Murata%20Electronics%20North%20America/view-part/494424/?ref=snap; Package: 1005 Murata; Digi-Key_Purchase_URL: https://www.digikey.com.au/product-detail/en/murata-electronics/LQW15ANR12J00D/490-4091-1-ND/1016351?utm_source=snapeda&utm_medium=aggregator&utm_campaign=symbol
LED1 = VLMB1500-GS08: CHIPLED(0402) BLUE ULTRABRIGHT -e4; Manufacturer_Name: Vishay; Copyright: Copyright (C) 2025 Ultra Librarian. All rights reserved.; MPN: VLMB1500-GS08
Q1 = DMC2990UDJ-7: Complem. Pair Enhancement MOSFET SOT-963; Manufacturer_Name: Diodes Incorporated; Geometry.Height: 0.5mm; Mouser Part Number: 621-DMC2990UDJ-7; Mouser Price/Stock: https://www.mouser.co.uk/ProductDetail/Diodes-Incorporated/DMC2990UDJ-7?qs=T%2FOtf55vL7d00qRGlt4Fcw%3D%3D; MPN: DMC2990UDJ-7; Datasheet Link: https://www.diodes.com//assets/Datasheets/DMC2990UDJ.pdf
R1 = ERJ-2RKF3001X: Res Thick Film 0402 3K Ohm 1% 0.1W ±100ppm/°C Molded SMD Punched Carrier T/R; Manufacturer: Panasonic; Max Power Dissipation: 100mW; Value: 3kΩ; Voltage Rating: 50V; Supplier: DigiKey; Supplier Part Number: P3.00KLCT-ND; MPN: ERJ-2RKF3001X; RoHS: Compliant; Category: Chip SMD Resistors; Stock: 193068; Pricing: 1=0.1, 10=0.028, 25=0.0208, 50=0.0168, 100=0.0138, 250=0.01072, 500=0.009, 1000=0.00766, 5000=0.00554 (USD); Case/Package: 0402; Case Code (Imperial): 0402; Case Code (Metric): 1005; China RoHS: Non-Compliant; Composition: Thick Film; Contact Plating: Tin; Depth: 500µm; Features: Automotive AEC-Q200; Height: 350µm; Lead Free: Lead Free; Length: 1mm; Lifecycle Status: Production; Max Operating Temperature: 155°C; Military Standard: Not; Min Operating Temperature: -55°C; Mounting Technology: Surface Mount; Number of Terminals: 2; Number of Terminations: 2; Packaging: Cut Tape; Power Dissipation: 100mW; Power Rating: 100mW; Radiation Hardening: No; REACH SVHC: Yes; Schedule B: 8533210045, 8533210045|8533210045, 8533210045|8533210045|8533210045, 8533210045|8533210045|8533210045|8533210045; Temperature Coefficient: 100ppm/°C; Termination: SMD/SMT; Tolerance: 1%; Voltage Rating (DC): 50V; Width: 500µm; Working Voltage: 50V; ComponentLink1URL: https://sigma.octopart.com:443/138766958/technical_drawing/Panasonic-ERJ-2RKF3001X.pdf?src-supplier=Upverter; ComponentLink1Description: https://sigma.octopart.com:443/138766958/technical_drawing/Panasonic-ERJ-2RKF3001X.pdf?src-supplier=Upverter; ComponentLink2URL: https://datasheet.octopart.com:443/ERJ-2RKF3001X-Panasonic-datasheet-82288794.pdf?src-supplier=Panasonic+SCT; ComponentLink2Description: https://datasheet.octopart.com:443/ERJ-2RKF3001X-Panasonic-datasheet-82288794.pdf?src-supplier=Panasonic+SCT; ComponentLink3URL: https://datasheet.octopart.com:443/ERJ-2RKF3001X-Panasonic-datasheet-13266541.pdf?src-supplier=Future+Electronics; ComponentLink3Description: https://datasheet.octopart.com:443/ERJ-2RKF3001X-Panasonic-datasheet-13266541.pdf?src-supplier=Future+Electronics; ComponentLink4URL: https://datasheet.octopart.com:443/ERJ-2RKF3001X-Panasonic-datasheet-10025800.pdf?src-supplier=Future+Electronics; ComponentLink4Description: https://datasheet.octopart.com:443/ERJ-2RKF3001X-Panasonic-datasheet-10025800.pdf?src-supplier=Future+Electronics; ComponentLink5URL: https://datasheet.octopart.com:443/ERJ-2RKF3001X-Panasonic-datasheet-8853621.pdf?src-supplier=Future+Electronics; ComponentLink5Description: https://datasheet.octopart.com:443/ERJ-2RKF3001X-Panasonic-datasheet-8853621.pdf?src-supplier=Future+Electronics; ComponentLink6URL: https://datasheet.octopart.com:443/ERJ-2RKF3001X-Panasonic-datasheet-5313456.pdf?src-supplier=Future+Electronics; ComponentLink6Description: https://datasheet.octopart.com:443/ERJ-2RKF3001X-Panasonic-datasheet-5313456.pdf?src-supplier=Future+Electronics; ComponentLink7URL: https://datasheet.octopart.com:443/ERJ-2RKF3001X-Panasonic-datasheet-48891056.pdf?src-supplier=Newark; ComponentLink7Description: https://datasheet.octopart.com:443/ERJ-2RKF3001X-Panasonic-datasheet-48891056.pdf?src-supplier=Newark; ComponentLink8URL: https://datasheet.octopart.com:443/ERJ-2RKF3001X-Panasonic-datasheet-136608610.pdf?src-supplier=Newark; ComponentLink8Description: https://datasheet.octopart.com:443/ERJ-2RKF3001X-Panasonic-datasheet-136608610.pdf?src-supplier=Newark; ComponentLink9URL: https://datasheet.octopart.com:443/ERJ-2RKF3001X-Panasonic-datasheet-33006990.pdf?src-supplier=Newark; ComponentLink9Description: https://datasheet.octopart.com:443/ERJ-2RKF3001X-Panasonic-datasheet-33006990.pdf?src-supplier=Newark; ComponentLink10URL: https://datasheet.octopart.com:443/ERJ2RKF3001X-Panasonic-datasheet-21211697.pdf?src-supplier=element14+APAC; ComponentLink10Description: https://datasheet.octopart.com:443/ERJ2RKF3001X-Panasonic-datasheet-21211697.pdf?src-supplier=element14+APAC; ComponentLink11URL: https://datasheet.octopart.com:443/ERJ-2RKF3001X-Panasonic-datasheet-154766169.pdf?src-supplier=Master+Electronics; ComponentLink11Description: https://datasheet.octopart.com:443/ERJ-2RKF3001X-Panasonic-datasheet-154766169.pdf?src-supplier=Master+Electronics; ComponentLink12URL: https://datasheet.octopart.com:443/ERJ2RKF3001X-Panasonic-datasheet-188592431.pdf?src-supplier=TME; ComponentLink12Description: https://datasheet.octopart.com:443/ERJ2RKF3001X-Panasonic-datasheet-188592431.pdf?src-supplier=TME; ComponentLink13URL: https://datasheet.octopart.com:443/ERJ2RKF3001X-Panasonic-datasheet-164353789.pdf?src-supplier=TME; ComponentLink13Description: https://datasheet.octopart.com:443/ERJ2RKF3001X-Panasonic-datasheet-164353789.pdf?src-supplier=TME; ComponentLink14URL: https://datasheet.octopart.com/ERJ-2RKF3001X-Panasonic-datasheet-78375410.pdf; ComponentLink14Description: https://datasheet.octopart.com/ERJ-2RKF3001X-Panasonic-datasheet-78375410.pdf; ComponentLink15URL: https://datasheet.octopart.com:443/ERJ-2RKF3001X-Panasonic---ECG-datasheet-15994758.pdf?src-supplier=Farnell; ComponentLink15Description: https://datasheet.octopart.com:443/ERJ-2RKF3001X-Panasonic---ECG-datasheet-15994758.pdf?src-supplier=Farnell; ComponentLink16URL: https://datasheet.octopart.com:443/ERJ-2RKF3001X-Panasonic-datasheet-11542829.pdf?src-supplier=Arrow+Electronics; ComponentLink16Description: https://datasheet.octopart.com:443/ERJ-2RKF3001X-Panasonic-datasheet-11542829.pdf?src-supplier=Arrow+Electronics; ComponentLink17URL: https://datasheet.octopart.com:443/ERJ-2RKF3001X-Panasonic-datasheet-41391857.pdf?src-supplier=Electro+Sonic; ComponentLink17Description: https://datasheet.octopart.com:443/ERJ-2RKF3001X-Panasonic-datasheet-41391857.pdf?src-supplier=Electro+Sonic
R2 R14 = CRCW0402100RFKEDHP: Res Thick Film 0402 100 Ohm 1% 0.2W ±100ppm/°C Molded SMD SMD Paper T/R; Manufacturer: Vishay; Manufacturer Package Identifier: CRCW0402-HPe3; Power Dissipation: 200mW; Value: 100Ω; Voltage Rating: 50V; Supplier: DigiKey; Supplier Part Number: 541-100YCT-ND; MPN: CRCW0402100RFKEDHP; RoHS: Compliant; Category: Chip SMD Resistors; Stock: 523985; Pricing: 1=0.11, 10=0.054, 25=0.0412, 50=0.034, 100=0.0286, 250=0.02312, 500=0.02002, 1000=0.01755, 5000=0.01363 (USD); Case/Package: 0402; Case Code (Imperial): 0402; Case Code (Metric): 1005; China RoHS: Non-Compliant; Composition: Thick Film; Contact Plating: Tin; Depth: 500µm; Height: 300µm; Lead Free: Lead Free; Length: 1mm; Lifecycle Status: Production; Max Operating Temperature: 155°C; Min Operating Temperature: -55°C; Mounting Technology: Surface Mount; Number of Terminals: 2; Packaging: Cut Tape; Power Rating: 200mW; Radiation Hardening: No; REACH SVHC: Yes; Schedule B: 8533210045, 8533210045|8533210045|8533210045|8533210045|8533210045|8533210045|8533210045, 8533210045|8533210045|8533210045|8533210045|8533210045|8533210045|8533210045|8533210045, 8533210045|8533210045|8533210045|8533210045|8533210045|8533210045|8533210045|8533210045|8533210045; Temperature Coefficient: 100ppm/°C; Termination: SMD/SMT; Tolerance: 1%; Voltage Rating (DC): 50V; Weight: 652.039032µg; Width: 500µm; Working Voltage: 50V; ComponentLink1URL: https://datasheet.octopart.com/CRCW0402100RFKEDHP-Vishay-datasheet-83567917.pdf; ComponentLink1Description: https://datasheet.octopart.com/CRCW0402100RFKEDHP-Vishay-datasheet-83567917.pdf; ComponentLink2URL: https://datasheet.octopart.com/D-CRCW-e3-Standard-Thick-Film-Chip-Resistors-Vishay-datasheet-family-64.pdf; ComponentLink2Description: https://datasheet.octopart.com/D-CRCW-e3-Standard-Thick-Film-Chip-Resistors-Vishay-datasheet-family-64.pdf; ComponentLink3URL: https://datasheet.octopart.com:443/CRCW0402100RFKEDHP-Vishay-datasheet-87136057.pdf?src-supplier=element14+APAC; ComponentLink3Description: https://datasheet.octopart.com:443/CRCW0402100RFKEDHP-Vishay-datasheet-87136057.pdf?src-supplier=element14+APAC; ComponentLink4URL: https://datasheet.octopart.com:443/CRCW0402100RFKEDHP-Vishay-datasheet-78776210.pdf?src-supplier=element14+APAC; ComponentLink4Description: https://datasheet.octopart.com:443/CRCW0402100RFKEDHP-Vishay-datasheet-78776210.pdf?src-supplier=element14+APAC; ComponentLink5URL: https://datasheet.octopart.com:443/CRCW0402100RFKEDHP-Vishay-datasheet-62317933.pdf?src-supplier=element14+APAC; ComponentLink5Description: https://datasheet.octopart.com:443/CRCW0402100RFKEDHP-Vishay-datasheet-62317933.pdf?src-supplier=element14+APAC; ComponentLink6URL: https://datasheet.octopart.com:443/CRCW0402100RFKEDHP-Vishay-datasheet-37143532.pdf?src-supplier=element14+APAC; ComponentLink6Description: https://datasheet.octopart.com:443/CRCW0402100RFKEDHP-Vishay-datasheet-37143532.pdf?src-supplier=element14+APAC; ComponentLink7URL: https://datasheet.octopart.com:443/CRCW0402100RFKEDHP-Vishay-datasheet-66581887.pdf?src-supplier=element14+APAC; ComponentLink7Description: https://datasheet.octopart.com:443/CRCW0402100RFKEDHP-Vishay-datasheet-66581887.pdf?src-supplier=element14+APAC; ComponentLink8URL: https://datasheet.octopart.com:443/CRCW0402100RFKEDHP-Vishay-datasheet-13148866.pdf?src-supplier=_legacy+Avnet; ComponentLink8Description: https://datasheet.octopart.com:443/CRCW0402100RFKEDHP-Vishay-datasheet-13148866.pdf?src-supplier=_legacy+Avnet; ComponentLink9URL: https://datasheet.octopart.com:443/CRCW0402100RFKEDHP-Vishay-datasheet-13131392.pdf?src-supplier=_legacy+Avnet; ComponentLink9Description: https://datasheet.octopart.com:443/CRCW0402100RFKEDHP-Vishay-datasheet-13131392.pdf?src-supplier=_legacy+Avnet; ComponentLink10URL: https://datasheet.octopart.com:443/CRCW0402100RFKEDHP-Vishay-datasheet-12593106.pdf?src-supplier=_legacy+Avnet; ComponentLink10Description: https://datasheet.octopart.com:443/CRCW0402100RFKEDHP-Vishay-datasheet-12593106.pdf?src-supplier=_legacy+Avnet; ComponentLink11URL: https://datasheet.octopart.com:443/CRCW0402100RFKEDHP-Vishay-datasheet-12544674.pdf?src-supplier=_legacy+Avnet; ComponentLink11Description: https://datasheet.octopart.com:443/CRCW0402100RFKEDHP-Vishay-datasheet-12544674.pdf?src-supplier=_legacy+Avnet; ComponentLink12URL: https://datasheet.octopart.com:443/CRCW0402100RFKEDHP-Vishay-datasheet-12531795.pdf?src-supplier=_legacy+Avnet; ComponentLink12Description: https://datasheet.octopart.com:443/CRCW0402100RFKEDHP-Vishay-datasheet-12531795.pdf?src-supplier=_legacy+Avnet; ComponentLink13URL: https://datasheet.octopart.com:443/CRCW0402100RFKEDHP-Vishay-datasheet-12518686.pdf?src-supplier=_legacy+Avnet; ComponentLink13Description: https://datasheet.octopart.com:443/CRCW0402100RFKEDHP-Vishay-datasheet-12518686.pdf?src-supplier=_legacy+Avnet; ComponentLink14URL: https://datasheet.octopart.com:443/CRCW0402100RFKEDHP-Vishay-datasheet-12509906.pdf?src-supplier=_legacy+Avnet; ComponentLink14Description: https://datasheet.octopart.com:443/CRCW0402100RFKEDHP-Vishay-datasheet-12509906.pdf?src-supplier=_legacy+Avnet; ComponentLink15URL: https://datasheet.octopart.com:443/CRCW0402100RFKEDHP-Vishay-datasheet-10669844.pdf?src-supplier=_legacy+Avnet; ComponentLink15Description: https://datasheet.octopart.com:443/CRCW0402100RFKEDHP-Vishay-datasheet-10669844.pdf?src-supplier=_legacy+Avnet; ComponentLink16URL: https://datasheet.octopart.com:443/CRCW0402100RFKEDHP-Vishay-datasheet-8703221.pdf?src-supplier=_legacy+Avnet; ComponentLink16Description: https://datasheet.octopart.com:443/CRCW0402100RFKEDHP-Vishay-datasheet-8703221.pdf?src-supplier=_legacy+Avnet; ComponentLink17URL: https://datasheet.octopart.com:443/CRCW0402100RFKEDHP-Vishay-datasheet-62316122.pdf?src-supplier=Future+Electronics; ComponentLink17Description: https://datasheet.octopart.com:443/CRCW0402100RFKEDHP-Vishay-datasheet-62316122.pdf?src-supplier=Future+Electronics; ComponentLink18URL: https://datasheet.octopart.com:443/CRCW0402100RFKEDHP-Vishay-Dale-datasheet-47688881.pdf?src-supplier=RS+(Formerly+Allied+Electronics); ComponentLink18Description: https://datasheet.octopart.com:443/CRCW0402100RFKEDHP-Vishay-Dale-datasheet-47688881.pdf?src-supplier=RS+(Formerly+Allied+Electronics); ComponentLink19URL: https://datasheet.octopart.com:443/CRCW0402100RFKEDHP-Vishay-datasheet-8359436.pdf?src-supplier=Newark; ComponentLink19Description: https://datasheet.octopart.com:443/CRCW0402100RFKEDHP-Vishay-datasheet-8359436.pdf?src-supplier=Newark; ComponentLink20URL: http://sigma.octopart.com:80/rohs_certificate/D-CRCW-e3-Standard-Thick-Film-Chip-Resistors-Vishay-family-102.pdf?src-supplier=Compliance+Statements; ComponentLink20Description: http://sigma.octopart.com:80/rohs_certificate/D-CRCW-e3-Standard-Thick-Film-Chip-Resistors-Vishay-family-102.pdf?src-supplier=Compliance+Statements
R3 R4 = RC0402FR-135K1L: Res Thick Film 0402 5.1K Ohm 1% 0.063W(1/16W) ±100ppm/C Pad SMD T/R; Manufacturer: Yageo Group; Power Dissipation: 62.5mW; Value: 5.1kΩ; Temperature Coefficient: 100ppm/°C; Voltage Rating: 50V; Supplier: DigiKey; Supplier Part Number: 13-RC0402FR-135K1LCT-ND; MPN: RC0402FR-135K1L; RoHS: Compliant; Category: Chip SMD Resistors; Stock: 214134; Pricing: 1=0.1, 10=0.005, 25=0.0044, 50=0.004, 100=0.0036, 250=0.00328 (USD); Case/Package: 0402; Case Code (Imperial): 0402; Case Code (Metric): 1005; China RoHS: Non-Compliant; Composition: Thick Film; Contact Plating: Tin; Height: 350µm; Length: 1mm; Lifecycle Status: Production; Max Operating Temperature: 155°C; Min Operating Temperature: -55°C; Mounting Technology: Surface Mount; Number of Terminals: 2; Packaging: Tape & Reel; Power Rating: 62.5mW; Radiation Hardening: No; REACH SVHC: Yes; Termination: SMD/SMT; Tolerance: 1%; Width: 500µm; Working Voltage: 50V; ComponentLink1URL: https://datasheet.octopart.com:443/RC0402FR-135K1L-Yageo-datasheet-175887523.pdf?src-supplier=IHS; ComponentLink1Description: https://datasheet.octopart.com:443/RC0402FR-135K1L-Yageo-datasheet-175887523.pdf?src-supplier=IHS; ComponentLink2URL: https://datasheet.octopart.com:443/RC0402FR-135K1L-Yageo-datasheet-164759695.pdf?src-supplier=Future+Electronics; ComponentLink2Description: https://datasheet.octopart.com:443/RC0402FR-135K1L-Yageo-datasheet-164759695.pdf?src-supplier=Future+Electronics; ComponentLink3URL: https://datasheet.octopart.com/RC0402FR-135K1L-Yageo-datasheet-73766026.pdf; ComponentLink3Description: https://datasheet.octopart.com/RC0402FR-135K1L-Yageo-datasheet-73766026.pdf; ComponentLink4URL: https://datasheet.octopart.com:443/RC0402FR-135K1L-Yageo-datasheet-10408619.pdf?src-supplier=_legacy+Avnet; ComponentLink4Description: https://datasheet.octopart.com:443/RC0402FR-135K1L-Yageo-datasheet-10408619.pdf?src-supplier=_legacy+Avnet; ComponentLink5URL: http://sigma.octopart.com:80/conflict_mineral_statement/Yageo-company-3.pdf?src-supplier=Compliance+Statements; ComponentLink5Description: http://sigma.octopart.com:80/conflict_mineral_statement/Yageo-company-3.pdf?src-supplier=Compliance+Statements; ComponentLink6URL: http://sigma.octopart.com:80/rohs_statement/Yageo-company-2.pdf?src-supplier=Compliance+Statements; ComponentLink6Description: http://sigma.octopart.com:80/rohs_statement/Yageo-company-2.pdf?src-supplier=Compliance+Statements